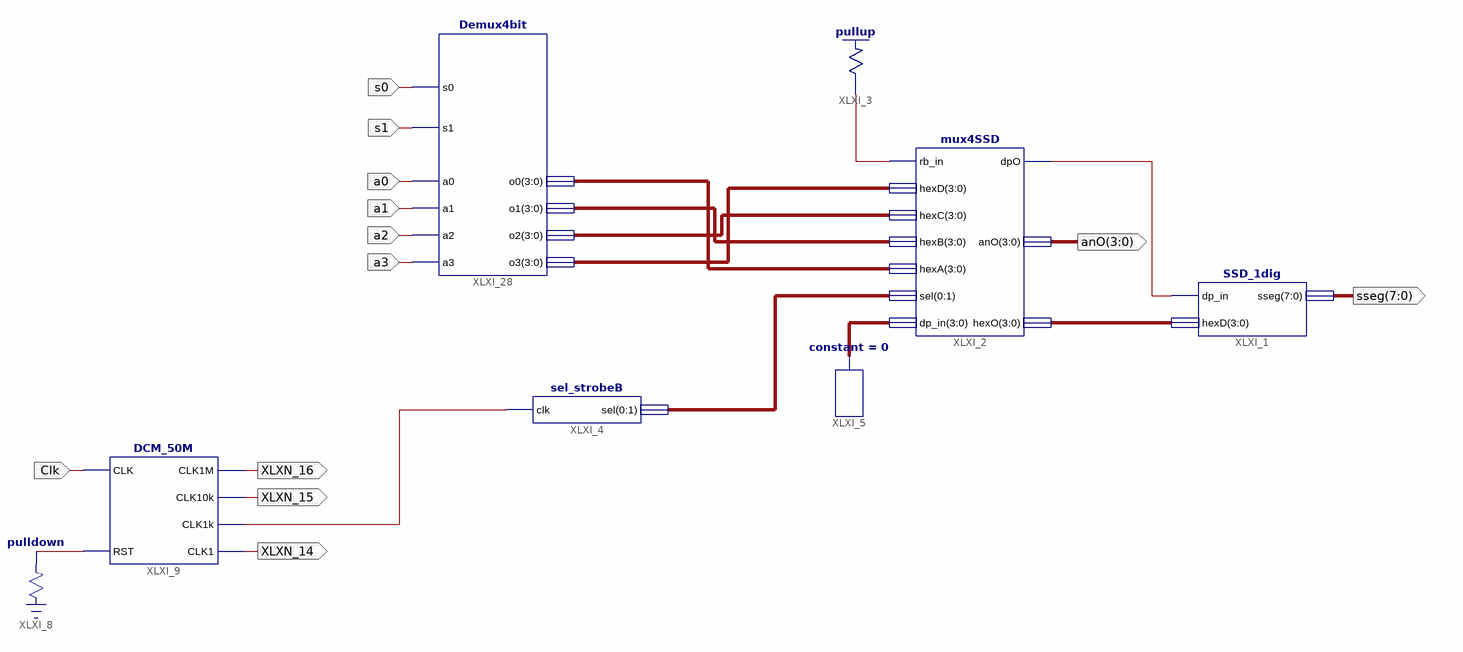
[diagram p0: schematic sheet 1]
// Xilinx ISE schematic Lab6Exp6.sch (spartan3e) as structural Verilog: 8 symbols, 12 ports
module Lab6Exp6 (
  input  Clk,
  input  s0,
  input  s1,
  input  a0,
  input  a1,
  input  a2,
  input  a3,
  output [3:0] anO,
  output [7:0] sseg,
  output XLXN_14,
  output XLXN_15,
  output XLXN_16
);

  wire XLXN_12, XLXN_18, XLXN_21, XLXN_49;
  wire [1:0] XLXN_59;
  wire [3:0] XLXN_1, XLXN_3, XLXN_60, XLXN_61, XLXN_62, XLXN_63;

  SSD_1dig XLXI_1 (.dp_in(XLXN_49), .hexD(XLXN_1), .sseg(sseg));
  mux4SSD XLXI_2 (
    .rb_in(XLXN_12), .hexD(XLXN_60), .hexC(XLXN_61), .hexB(XLXN_62), .hexA(XLXN_63),
    .sel({XLXN_59[0], XLXN_59[1]}), .dp_in(XLXN_3), .dpO(XLXN_49), .anO(anO), .hexO(XLXN_1));
  \pullup  XLXI_3 (.O(XLXN_12));
  sel_strobeB XLXI_4 (.clk(XLXN_21), .sel({XLXN_59[0], XLXN_59[1]}));
  constant #(.CValue("0")) XLXI_5 (.O(XLXN_3));
  \pulldown  XLXI_8 (.O(XLXN_18));
  DCM_50M XLXI_9 (.CLK(Clk), .RST(XLXN_18), .CLK1M(XLXN_16), .CLK10k(XLXN_15), .CLK1k(XLXN_21), .CLK1(XLXN_14));
  Demux4bit XLXI_28 (
    .s0(s0), .s1(s1), .a0(a0), .a1(a1), .a2(a2), .a3(a3), .o0(XLXN_63), .o1(XLXN_62), .o2(XLXN_61),
    .o3(XLXN_60));
endmodule
